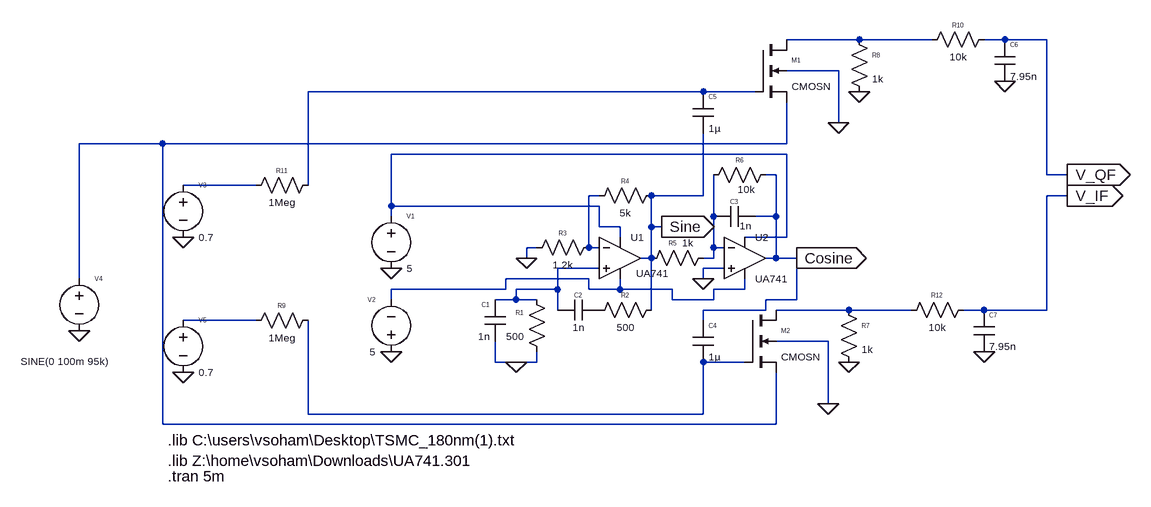
[diagram p0: schematic AEC_Project_FInal Circuit_QDC.asc]
AEC_Project_FInal Circuit_QDC.asc, the LTspice schematic file:
Version 4
SHEET 1 924 680
WIRE 480 -176 368 -176
WIRE 592 -176 480 -176
WIRE 704 -176 672 -176
WIRE 768 -176 704 -176
WIRE 448 -128 368 -128
WIRE 240 -96 -368 -96
WIRE 320 -96 240 -96
WIRE 448 -48 448 -128
WIRE -592 -16 -720 -16
WIRE 368 -16 368 -80
WIRE 368 -16 -592 -16
WIRE 368 0 -240 0
WIRE 352 32 336 32
WIRE 768 32 768 -176
WIRE 800 32 768 32
WIRE -448 48 -560 48
WIRE -368 48 -368 -96
WIRE 80 64 64 64
WIRE 240 64 240 -32
WIRE 240 64 160 64
WIRE 800 64 768 64
WIRE -240 80 -240 0
WIRE 80 80 -240 80
WIRE -240 96 -240 80
WIRE 256 96 256 32
WIRE 352 96 352 32
WIRE 352 96 320 96
WIRE 80 112 80 80
WIRE 112 112 80 112
WIRE 160 112 160 64
WIRE 176 112 160 112
WIRE 112 128 112 112
WIRE 368 128 368 0
WIRE 368 128 304 128
WIRE -16 144 -32 144
WIRE 64 144 64 64
WIRE 80 144 64 144
WIRE 256 144 256 96
WIRE 272 144 256 144
WIRE -32 160 -32 144
WIRE 160 160 160 112
WIRE 160 160 144 160
WIRE 256 160 256 144
WIRE 256 160 240 160
WIRE 352 160 352 96
WIRE 352 160 336 160
WIRE 384 160 352 160
WIRE 80 176 16 176
WIRE 272 176 240 176
WIRE -720 192 -720 -16
WIRE 64 192 -64 192
WIRE 240 192 240 176
WIRE -64 208 -64 192
WIRE -64 208 -240 208
WIRE 16 208 16 176
WIRE 16 208 -48 208
WIRE 64 208 64 192
WIRE 112 208 112 192
WIRE 112 208 64 208
WIRE 192 208 112 208
WIRE 304 208 304 192
WIRE 304 208 256 208
WIRE -240 224 -240 208
WIRE -48 224 -48 208
WIRE -48 224 -80 224
WIRE -16 224 -48 224
WIRE 192 224 192 208
WIRE 256 224 256 208
WIRE 256 224 192 224
WIRE 384 224 384 160
WIRE 384 224 336 224
WIRE 16 240 16 208
WIRE 160 240 160 160
WIRE 336 240 336 224
WIRE 336 240 240 240
WIRE 464 240 352 240
WIRE 560 240 464 240
WIRE 672 240 640 240
WIRE 768 240 768 64
WIRE 768 240 672 240
WIRE -448 256 -560 256
WIRE 240 256 240 240
WIRE 432 288 352 288
WIRE -80 320 -80 288
WIRE -48 320 -80 320
WIRE -16 320 -16 304
WIRE -16 320 -48 320
WIRE 304 320 240 320
WIRE 432 384 432 288
WIRE -368 400 -368 256
WIRE 240 400 240 320
WIRE 240 400 -368 400
WIRE -592 416 -592 -16
WIRE 352 416 352 336
WIRE 352 416 -592 416
FLAG 176 112 Sine
IOPIN 176 112 Out
FLAG 384 160 Cosine
IOPIN 384 160 Out
FLAG 240 192 0
FLAG -48 320 0
FLAG -32 160 0
FLAG -240 304 0
FLAG -240 176 0
FLAG -560 128 0
FLAG -720 272 0
FLAG 448 -48 0
FLAG 432 384 0
FLAG 464 320 0
FLAG 480 -96 0
FLAG -560 336 0
FLAG 704 -112 0
FLAG 672 304 0
FLAG 800 64 V_IF
IOPIN 800 64 Out
FLAG 800 32 V_QF
IOPIN 800 32 Out
SYMBOL OpAmps\\opamp2 112 96 R0
WINDOW 0 16 32 Left 1
WINDOW 3 25 87 Left 1
SYMATTR InstName U1
SYMATTR Value UA741
SYMBOL OpAmps\\opamp2 304 96 R0
WINDOW 0 16 32 Left 1
WINDOW 3 16 96 Left 1
SYMATTR InstName U2
SYMATTR Value UA741
SYMBOL res 256 144 R90
WINDOW 0 0 63 VBottom 0
WINDOW 3 -18 40 VTop 1
SYMATTR InstName R5
SYMATTR Value 1k
SYMBOL cap 320 80 R90
WINDOW 0 0 32 VBottom 0
WINDOW 3 20 15 VTop 1
SYMATTR InstName C3
SYMATTR Value 1n
SYMBOL res 352 16 R90
WINDOW 0 0 56 VBottom 0
WINDOW 3 28 46 VTop 1
SYMATTR InstName R6
SYMATTR Value 10k
SYMBOL res 176 48 R90
WINDOW 0 0 56 VBottom 0
WINDOW 3 32 56 VTop 1
SYMATTR InstName R4
SYMATTR Value 5k
SYMBOL res 80 128 R90
WINDOW 0 0 56 VBottom 0
WINDOW 3 32 56 VTop 1
SYMATTR InstName R3
SYMATTR Value 1.2k
SYMBOL res 176 224 R90
WINDOW 0 0 56 VBottom 0
WINDOW 3 32 56 VTop 1
SYMATTR InstName R2
SYMATTR Value 500
SYMBOL res 0 320 R180
WINDOW 0 36 76 Left 0
WINDOW 3 36 40 Left 1
SYMATTR InstName R1
SYMATTR Value 500
SYMBOL cap 80 224 R90
WINDOW 0 0 32 VBottom 0
WINDOW 3 32 32 VTop 1
SYMATTR InstName C2
SYMATTR Value 1n
SYMBOL cap -64 288 R180
WINDOW 0 24 56 Left 0
WINDOW 3 24 8 Left 1
SYMATTR InstName C1
SYMATTR Value 1n
SYMBOL voltage -240 80 R0
WINDOW 0 24 16 Left 0
WINDOW 3 24 96 Left 1
WINDOW 123 0 0 Left 0
WINDOW 39 0 0 Left 0
SYMATTR InstName V1
SYMATTR Value 5
SYMBOL voltage -240 320 R180
WINDOW 0 24 96 Left 0
WINDOW 3 24 16 Left 1
WINDOW 123 0 0 Left 0
WINDOW 39 0 0 Left 0
SYMATTR InstName V2
SYMATTR Value 5
SYMBOL nmos4 320 -176 R0
WINDOW 0 56 32 Left 0
WINDOW 3 56 72 Left 1
SYMATTR InstName M1
SYMATTR Value CMOSN
SYMATTR Value2 l=0.18u w=1.8u ad=0.81p as=0.81p pd=4.5u ps=4.5u
SYMBOL nmos4 304 240 R0
WINDOW 0 56 32 Left 0
WINDOW 3 56 72 Left 1
SYMATTR InstName M2
SYMATTR Value CMOSN
SYMATTR Value2 l=0.18u w=1.8u ad=0.81p as=0.81p pd=4.5u ps=4.5u
SYMBOL res 448 224 R0
WINDOW 0 36 40 Left 0
WINDOW 3 36 76 Left 1
SYMATTR InstName R7
SYMATTR Value 1k
SYMBOL res 464 -192 R0
WINDOW 0 36 40 Left 0
WINDOW 3 36 76 Left 1
SYMATTR InstName R8
SYMATTR Value 1k
SYMBOL voltage -560 32 R0
WINDOW 0 24 16 Left 0
WINDOW 3 24 96 Left 1
WINDOW 123 0 0 Left 0
WINDOW 39 0 0 Left 0
SYMATTR InstName V3
SYMATTR Value 0.7
SYMBOL res -352 32 R90
WINDOW 0 0 56 VBottom 0
WINDOW 3 32 56 VTop 1
SYMATTR InstName R11
SYMATTR Value 1Meg
SYMBOL cap 224 256 R0
WINDOW 0 24 8 Left 0
WINDOW 3 24 56 Left 1
SYMATTR InstName C4
SYMATTR Value 1µ
SYMBOL cap 224 -96 R0
WINDOW 0 24 8 Left 0
WINDOW 3 24 56 Left 1
SYMATTR InstName C5
SYMATTR Value 1µ
SYMBOL voltage -720 176 R0
WINDOW 0 24 16 Left 0
WINDOW 3 -90 143 Left 1
WINDOW 123 0 0 Left 0
WINDOW 39 0 0 Left 0
SYMATTR InstName V4
SYMATTR Value SINE(0 100m 95k)
SYMBOL res -352 240 R90
WINDOW 0 0 56 VBottom 0
WINDOW 3 32 56 VTop 1
SYMATTR InstName R9
SYMATTR Value 1Meg
SYMBOL voltage -560 240 R0
WINDOW 0 24 16 Left 0
WINDOW 3 24 96 Left 1
WINDOW 123 0 0 Left 0
WINDOW 39 0 0 Left 0
SYMATTR InstName V5
SYMATTR Value 0.7
SYMBOL res 688 -192 R90
WINDOW 0 0 56 VBottom 0
WINDOW 3 32 56 VTop 1
SYMATTR InstName R10
SYMATTR Value 10k
SYMBOL res 656 224 R90
WINDOW 0 0 56 VBottom 0
WINDOW 3 32 56 VTop 1
SYMATTR InstName R12
SYMATTR Value 10k
SYMBOL cap 688 -176 R0
WINDOW 0 24 8 Left 0
WINDOW 3 24 56 Left 1
SYMATTR InstName C6
SYMATTR Value 7.95n
SYMBOL cap 656 240 R0
WINDOW 0 24 8 Left 0
WINDOW 3 24 56 Left 1
SYMATTR InstName C7
SYMATTR Value 7.95n
TEXT -584 472 Left 2 !.lib Z:\\home\\vsoham\\Downloads\\UA741.301
TEXT -584 496 Left 2 !.tran 5m
TEXT -584 440 Left 2 !.lib C:\\users\\vsoham\\Desktop\\TSMC_180nm(1).txt

The netlist it stands for:
* AEC_Project_FInal Circuit_QDC.asc
XU1 N008 N006 N004 N009 Sine UA741  ; pins In+ In- V+ V- OUT
XU2 0 N007 N004 N009 Cosine UA741  ; pins In+ In- V+ V- OUT
R5 N007 Sine 1k
C3 Cosine N007 1n
R6 Cosine N007 10k
R4 Sine N006 5k
R3 N006 0 1.2k
R2 Sine P001 500
R1 0 N008 500
C2 P001 N008 1n
C1 0 N008 1n
V1 N004 0 5
V2 0 N009 5
M1 N001 N002 N003 0 CMOSN l=0.18u w=1.8u ad=0.81p as=0.81p pd=4.5u ps=4.5u
M2 N010 N012 N003 0 CMOSN l=0.18u w=1.8u ad=0.81p as=0.81p pd=4.5u ps=4.5u
R7 N010 0 1k
R8 N001 0 1k
V3 N005 0 0.7
R11 N002 N005 1Meg
C4 Cosine N012 1µ
C5 N002 Sine 1µ
V4 N003 0 SINE(0 100m 95k)
R9 N012 N011 1Meg
V5 N011 0 0.7
R10 V_QF N001 10k
R12 V_IF N010 10k
C6 V_QF 0 7.95n
C7 V_IF 0 7.95n
.model NMOS NMOS
.model PMOS PMOS
.lib standard.mos
.lib Z:\home\vsoham\Downloads\UA741.301
.tran 5m
.lib C:\users\vsoham\Desktop\TSMC_180nm(1).txt
.backanno
.end